# EAGLE design iBolit_main (EAGLE 7.5.0)
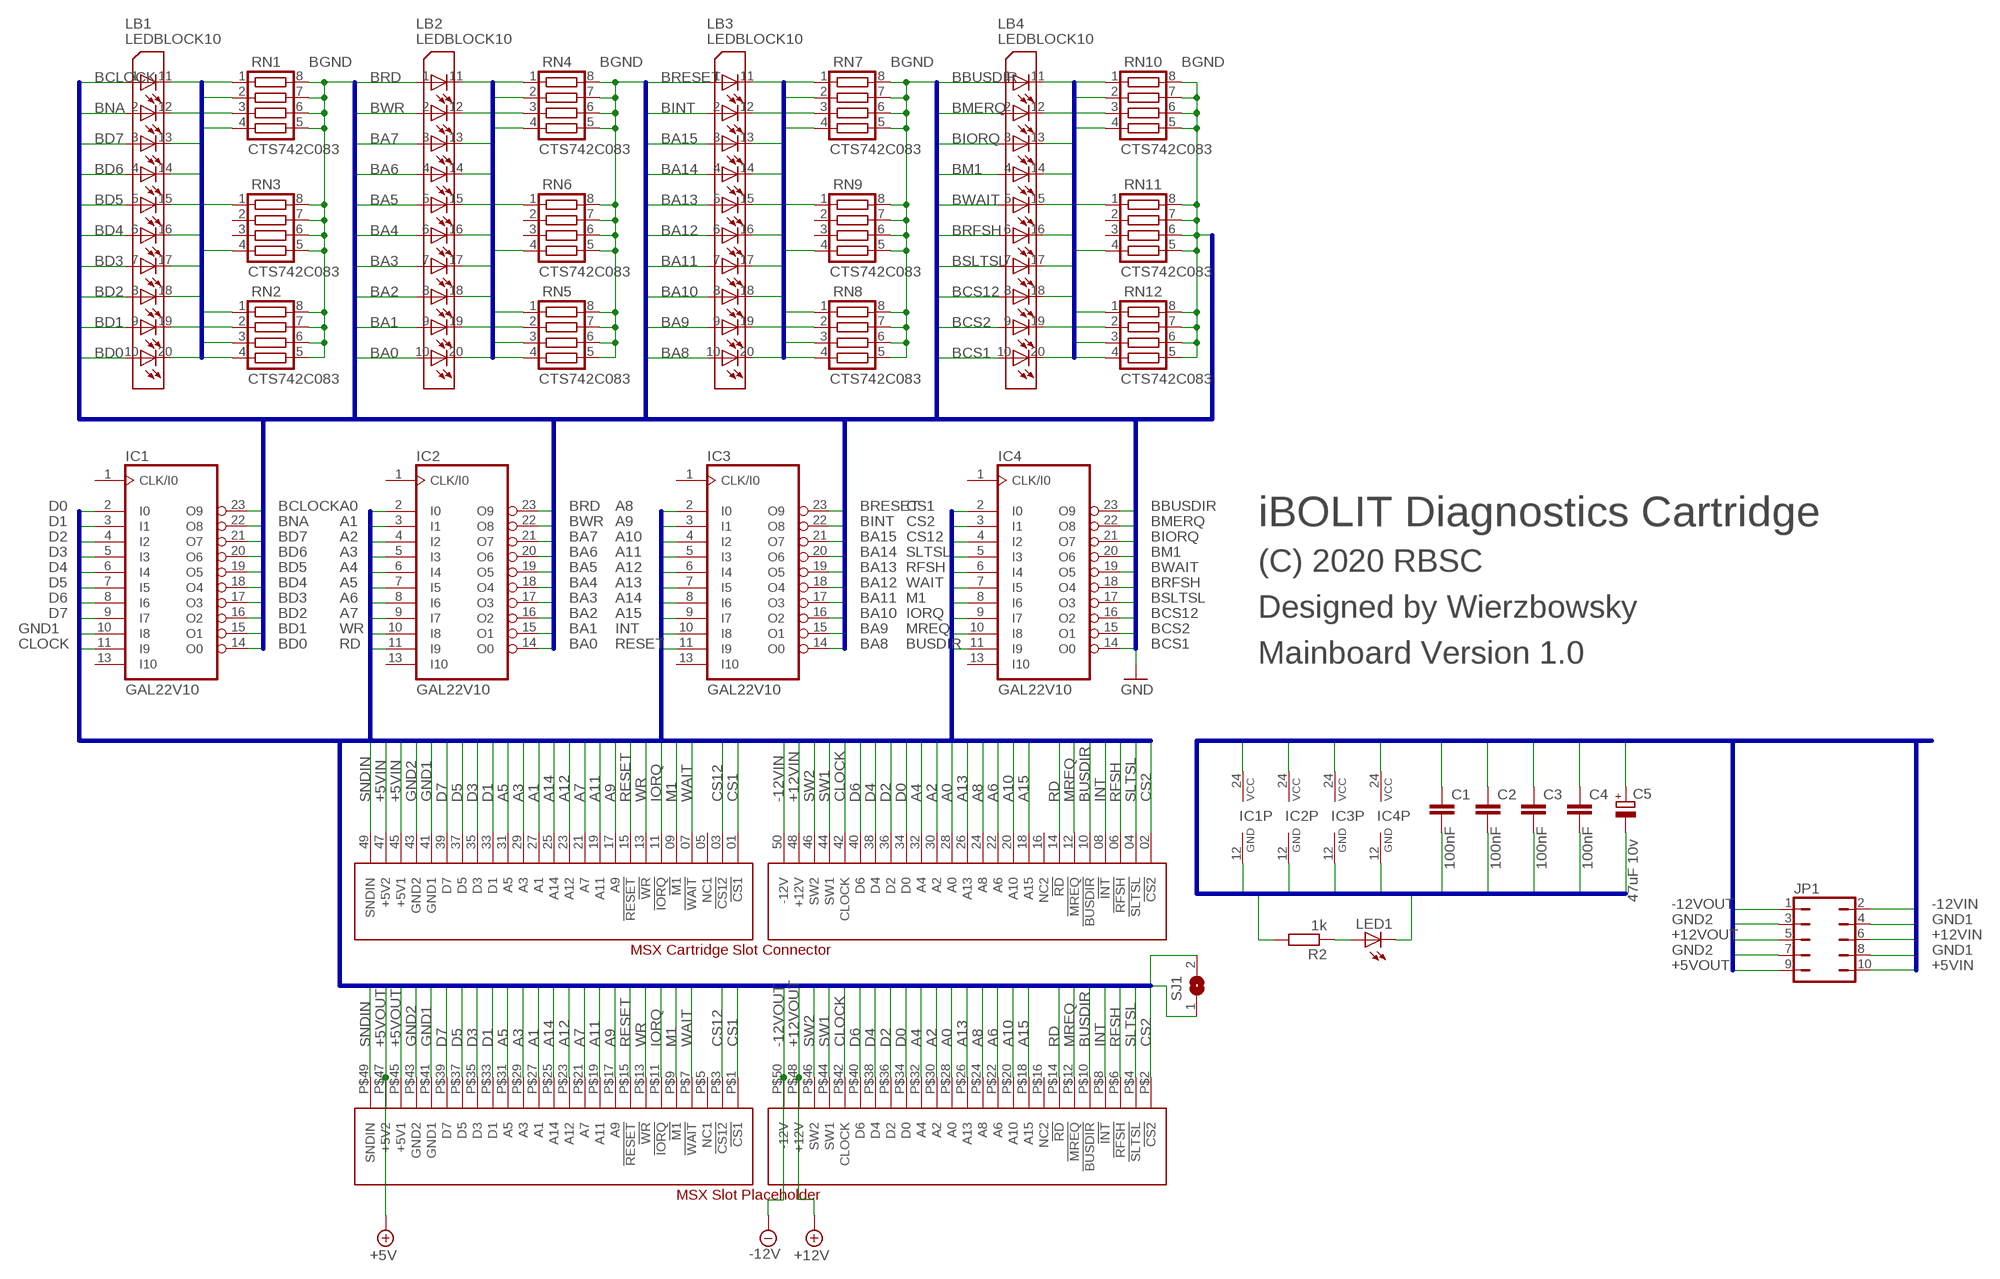
[diagram p0: schematic, sheet 1]

## Parts
C1  100nF  C-EUC0805  [C0805]
C2  100nF  C-EUC0805  [C0805]
C3  100nF  C-EUC0805  [C0805]
C4  100nF  C-EUC0805  [C0805]
C5  47uF 10v  CPOL-EUSMCB  [SMC_B]
CN1  SLOTCONN  MSX_SLOT_CON  [MSX_SLOT_CON]
CN2  SLOTPLACEHOLDER  MSX_SLOT_PLACEHOLDER  [MSX_SLOT_PLP]
IC1  GAL22V10  22V10  [DIL24-3]
IC2  GAL22V10  22V10  [DIL24-3]
IC3  GAL22V10  22V10  [DIL24-3]
IC4  GAL22V10  22V10  [DIL24-3]
JP1  JP5Q_CUSTOM  [JP5Q_CUSTOM]
LB1  LEDBLOCK10  [LB10]
LB2  LEDBLOCK10  [LB10]
LB3  LEDBLOCK10  [LB10]
LB4  LEDBLOCK10  [LB10]
LED1  LED5MM  [LED5MM]
R2  1k  R-EU_R0805  [R0805]
RN1  CTS742C083  [CTS742C083]
RN2  CTS742C083  [CTS742C083]
RN3  CTS742C083  [CTS742C083]
RN4  CTS742C083  [CTS742C083]
RN5  CTS742C083  [CTS742C083]
RN6  CTS742C083  [CTS742C083]
RN7  CTS742C083  [CTS742C083]
RN8  CTS742C083  [CTS742C083]
RN9  CTS742C083  [CTS742C083]
RN10  CTS742C083  [CTS742C083]
RN11  CTS742C083  [CTS742C083]
RN12  CTS742C083  [CTS742C083]
SJ1  SJ  [SJ]

## Nets
1: LB1.11(L1O) RN1.4
1A: LB2.11(L1O) RN4.4
1B: LB3.11(L1O) RN7.4
1C: LB4.11(L1O) RN10.4
2: LB1.12(L1O1) RN1.3
2A: LB2.12(L1O1) RN4.3
2B: LB3.12(L1O1) RN7.3
2C: LB4.12(L1O1) RN10.3
3: LB1.13(L1O2) RN1.2
3A: LB2.13(L1O2) RN4.2
3B: LB3.13(L1O2) RN7.2
3C: LB4.13(L1O2) RN10.2
4: LB1.14(L1O3) RN1.1
4A: LB2.14(L1O3) RN4.1
4B: LB3.14(L1O3) RN7.1
4C: LB4.14(L1O3) RN10.1
5: LB1.15(L1O4) RN3.4
5A: LB2.15(L1O4) RN6.4
5B: LB3.15(L1O4) RN9.4
5C: LB4.15(L1O4) RN11.4
6: LB1.16(L1O5) RN3.1
6A: LB2.16(L1O5) RN6.1
6B: LB3.16(L1O5) RN9.1
6C: LB4.16(L1O5) RN11.1
7: LB1.17(L1O6) RN2.4
7A: LB2.17(L1O6) RN5.4
7B: LB3.17(L1O6) RN8.4
7C: LB4.17(L1O6) RN12.4
8: LB1.18(L1O7) RN2.3
8A: LB2.18(L1O7) RN5.3
8B: LB3.18(L1O7) RN8.3
8C: LB4.18(L1O7) RN12.3
9: LB1.19(L1O8) RN2.2
9A: LB2.19(L1O8) RN5.2
9B: LB3.19(L1O8) RN8.2
9C: LB4.19(L1O8) RN12.2
10: LB1.20(L1O9) RN2.1
10A: LB2.20(L1O9) RN5.1
10B: LB3.20(L1O9) RN8.1
10C: LB4.20(L1O9) RN12.1
+5VIN: C1.1 C2.1 C3.1 C4.1 C5.+ CN1.45(+5V1) CN1.47(+5V2) IC1.24(VCC) IC2.24(VCC) IC3.24(VCC) IC4.24(VCC) JP1.10 R2.2
+5VOUT: CN2.P$45(+5V1) CN2.P$47(+5V2) JP1.9 ; supply symbol labelled +5V
+12VIN: CN1.48(+12V) JP1.6
+12VOUT: CN2.P$48(+12V) JP1.5 ; supply symbol labelled +12V
-12VIN: CN1.50(-12V) JP1.2
-12VOUT: CN2.P$50(-12V) JP1.1 ; supply symbol labelled -12V
A0: CN1.28(A0) CN2.P$28(A0) IC2.2(I0)
A1: CN1.27(A1) CN2.P$27(A1) IC2.3(I1)
A2: CN1.30(A2) CN2.P$30(A2) IC2.4(I2)
A3: CN1.29(A3) CN2.P$29(A3) IC2.5(I3)
A4: CN1.32(A4) CN2.P$32(A4) IC2.6(I4)
A5: CN1.31(A5) CN2.P$31(A5) IC2.7(I5)
A6: CN1.22(A6) CN2.P$22(A6) IC2.8(I6)
A7: CN1.21(A7) CN2.P$21(A7) IC2.9(I7)
A8: CN1.24(A8) CN2.P$24(A8) IC3.2(I0)
A9: CN1.17(A9) CN2.P$17(A9) IC3.3(I1)
A10: CN1.20(A10) CN2.P$20(A10) IC3.4(I2)
A11: CN1.19(A11) CN2.P$19(A11) IC3.5(I3)
A12: CN1.23(A12) CN2.P$23(A12) IC3.6(I4)
A13: CN1.26(A13) CN2.P$26(A13) IC3.7(I5)
A14: CN1.25(A14) CN2.P$25(A14) IC3.8(I6)
A15: CN1.18(A15) CN2.P$18(A15) IC3.9(I7)
BA0: IC2.14(O0) LB2.10(L1I9)
BA1: IC2.15(O1) LB2.9(L1I8)
BA2: IC2.16(O2) LB2.8(L1I7)
BA3: IC2.17(O3) LB2.7(L1I6)
BA4: IC2.18(O4) LB2.6(L1I5)
BA5: IC2.19(O5) LB2.5(L1I4)
BA6: IC2.20(O6) LB2.4(L1I3)
BA7: IC2.21(O7) LB2.3(L1I2)
BA8: IC3.14(O0) LB3.10(L1I9)
BA9: IC3.15(O1) LB3.9(L1I8)
BA10: IC3.16(O2) LB3.8(L1I7)
BA11: IC3.17(O3) LB3.7(L1I6)
BA12: IC3.18(O4) LB3.6(L1I5)
BA13: IC3.19(O5) LB3.5(L1I4)
BA14: IC3.20(O6) LB3.4(L1I3)
BA15: IC3.21(O7) LB3.3(L1I2)
BBUSDIR: IC4.23(O9) LB4.1(L1I)
BCLOCK: IC1.23(O9) LB1.1(L1I)
BCS1: IC4.14(O0) LB4.10(L1I9)
BCS2: IC4.15(O1) LB4.9(L1I8)
BCS12: IC4.16(O2) LB4.8(L1I7)
BD0: IC1.14(O0) LB1.10(L1I9)
BD1: IC1.15(O1) LB1.9(L1I8)
BD2: IC1.16(O2) LB1.8(L1I7)
BD3: IC1.17(O3) LB1.7(L1I6)
BD4: IC1.18(O4) LB1.6(L1I5)
BD5: IC1.19(O5) LB1.5(L1I4)
BD6: IC1.20(O6) LB1.4(L1I3)
BD7: IC1.21(O7) LB1.3(L1I2)
BGND: RN1.5 RN1.6 RN1.7 RN1.8 RN2.5 RN2.6 RN2.7 RN2.8 RN3.5 RN3.6 RN3.7 RN3.8 RN4.5 RN4.6 RN4.7 RN4.8 RN5.5 RN5.6 RN5.7 RN5.8 RN6.5 RN6.6 RN6.7 RN6.8 RN7.5 RN7.6 RN7.7 RN7.8 RN8.5 RN8.6 RN8.7 RN8.8 RN9.5 RN9.6 RN9.7 RN9.8 RN10.5 RN10.6 RN10.7 RN10.8 RN11.5 RN11.6 RN11.7 RN11.8 RN12.5 RN12.6 RN12.7 RN12.8 ; supply symbol labelled GND
BINT: IC3.22(O8) LB3.2(L1I1)
BIORQ: IC4.21(O7) LB4.3(L1I2)
BM1: IC4.20(O6) LB4.4(L1I3)
BMERQ: IC4.22(O8) LB4.2(L1I1)
BNA: IC1.22(O8) LB1.2(L1I1)
BRD: IC2.23(O9) LB2.1(L1I)
BRESET: IC3.23(O9) LB3.1(L1I)
BRFSH: IC4.18(O4) LB4.6(L1I5)
BSLTSL: IC4.17(O3) LB4.7(L1I6)
BUSDIR: CN1.10(!BUSDIR) CN2.P$10(!BUSDIR) IC4.11(I9)
BWAIT: IC4.19(O5) LB4.5(L1I4)
BWR: IC2.22(O8) LB2.2(L1I1)
CLOCK: CN1.42(CLOCK) CN2.P$42(CLOCK) IC1.11(I9)
CS1: CN1.01(!CS1) CN2.P$1(!CS1) IC4.2(I0)
CS2: CN1.02(!CS2) CN2.P$2(!CS2) IC4.3(I1)
CS12: CN1.03(!CS12) CN2.P$3(!CS12) IC4.4(I2)
D0: CN1.34(D0) CN2.P$34(D0) IC1.2(I0)
D1: CN1.33(D1) CN2.P$33(D1) IC1.3(I1)
D2: CN1.36(D2) CN2.P$36(D2) IC1.4(I2)
D3: CN1.35(D3) CN2.P$35(D3) IC1.5(I3)
D4: CN1.38(D4) CN2.P$38(D4) IC1.6(I4)
D5: CN1.37(D5) CN2.P$37(D5) IC1.7(I5)
D6: CN1.40(D6) CN2.P$40(D6) IC1.8(I6)
D7: CN1.39(D7) CN2.P$39(D7) IC1.9(I7)
GND1: C1.2 C2.2 C3.2 C4.2 C5.- CN1.41(GND1) CN2.P$41(GND1) IC1.10(I8) IC1.12(GND) IC2.12(GND) IC3.12(GND) IC4.12(GND) JP1.4 JP1.8 LED1.K(C)
GND2: CN1.43(GND2) CN2.P$43(GND2) JP1.3 JP1.7
INT: CN1.08(!INT) CN2.P$8(!INT) IC3.10(I8)
IORQ: CN1.11(!IORQ) CN2.P$11(!IORQ) IC4.9(I7)
M1: CN1.09(!M1) CN2.P$9(!M1) IC4.8(I6)
MREQ: CN1.12(!MREQ) CN2.P$12(!MREQ) IC4.10(I8)
N$1: LED1.A R2.1
RD: CN1.14(!RD) CN2.P$14(!RD) IC2.11(I9)
RESET: CN1.15(!RESET) CN2.P$15(!RESET) IC3.11(I9)
RFSH: CN1.06(!RFSH) CN2.P$6(!RFSH) IC4.6(I4)
SLTSL: CN1.04(!SLTSL) CN2.P$4(!SLTSL) IC4.5(I3)
SNDIN: CN1.49(SNDIN) CN2.P$49(SNDIN)
SW1: CN1.44(SW1) CN2.P$44(SW1) SJ1.2
SW2: CN1.46(SW2) CN2.P$46(SW2) SJ1.1
WAIT: CN1.07(!WAIT) CN2.P$7(!WAIT) IC4.7(I5)
WR: CN1.13(!WR) CN2.P$13(!WR) IC2.10(I8)
Unconnected: CN1.05(NC1) CN1.16(NC2) CN2.P$5(NC1) CN2.P$16(NC2) IC1.1(CLK/I0) IC1.13(I10) IC2.1(CLK/I0) IC2.13(I10) IC3.1(CLK/I0) IC3.13(I10) IC4.1(CLK/I0) IC4.13(I10) RN3.2 RN3.3 RN6.2 RN6.3 RN9.2 RN9.3 RN11.2 RN11.3

## Buses
D0,D1,D2,D3,D4,D5,D6,D7,A0,A1,A2,A3,A4,A5,A6,A7,A8,A9,A10,A11,A12,A13,A14,A15,SLTSL,RFSH,WAIT,INT,M1,BUSDIR,IORQ,MERQ,WR,RD,RESET,GND,CLOCK,SW1,SW2,CS1,CS2,CS12,SNDIN,GND1,GND2,+5V1,+5V2,+12V,-12V,+5VIN,+5VOUT,+12VIN,+12VOUT,-12VIN,-12VOUT,MREQ
BD0,BD1,BD2,BD3,BD4,BD5,BD6,BD7,BA0,BA1,BA2,BA3,BA4,BA5,BA6,BA7,BA8,BA9,BA10,BA11,BA12,BA13,BA14,BA15,BSLTSL,BRFSH,BWAIT,BINT,BM1,BBUSDIR,BIORQ,BMERQ,BWR,BRD,BRESET,BGND,BCLOCK,BCS1,BCS2,BCS12,BNA
1,2,3,4,5,6,7,8,9,10
1A,2A,3A,4A,5A,6A,7A,8A,9A,10A
1B,2B,3B,4B,5B,6B,7B,8B,9B,10B
1C,2C,3C,4C,5C,6C,7C,8C,9C,10C

## Notes on the sheet
- iBOLIT Diagnostics Cartridge
- (C) 2020 RBSC
- Designed by Wierzbowsky
- Mainboard Version 1.0

## Library data of the parts
C1-C4 = rcl:C-EU: CAPACITOR, European symbol
C5 = rcl:CPOL-EU: POLARIZED CAPACITOR, European symbol
CN1 = msx_edge_conn:MSX_SLOT_CON
CN2 = msx_slot_pl:MSX_SLOT_PLACEHOLDER
IC1-IC4 = pal:22V10: PAL; MPN: GAL22V10D-7LPN; OC_FARNELL: 1571925; OC_NEWARK: 97M0480
JP1 = jumper_custom:JP5Q_CUSTOM: JUMPER
LB1-LB4 = ledblock:LEDBLOCK10: LED BLOCK 10-LED bar graph, DIL, Siemens
LED1 = led:LED: LED OSRAM: - CHIPLED LG R971, LG N971, LY N971, LG Q971, LY Q971, LO R971, LY R971 LH N974, LH R974 LS Q976, LO Q976, LY Q976 LO Q996 - Hyper CHIPLED LW Q18S LB Q993, LB Q99A, LB R99A - SideLED LS A670, LO A670, LY A670, LG A670, LP A670 LB A673, LV A673, LT A673, LW A673 LH A674 LY A675 LS A676, LA A676, LO A676, LY A676, LW A676 LS A679, LY A679, LG A679 - Hyper Micro SIDELED® LS Y876, LA Y876, LO Y876, LY Y876 LT Y87S - SmartLED LW L88C, LW L88S LB L89C, LB L89S, LG L890 LS L89K, LO L89K, LY L89K LS L896, LA L896, LO L896, LY L896 - TOPLED LS T670, LO T670, LY T670, LG T670, LP T670 LSG T670, LSP T670, LSY T670, LOP T670, LYG T670 LG T671, LOG T671, LSG T671 LB T673, LV T673, LT T673, LW T673 LH T674 LS T676, LA T676, LO T676, LY T676, LB T676, LH T676, LSB T676, LW T676 LB T67C, LV T67C, LT T67C, LS T67K, LO T67K, LY T67K, LW E67C LS E67B, LA E67B, LO E67B, LY E67B, LB E67C, LV E67C, LT E67C LW T67C LS T679, LY T679, LG T679 LS T770, LO T770, LY T770, LG T770, LP T770 LB T773, LV T773, LT T773, LW T773 LH T774 LS E675, LA E675, LY E675, LS T675 LS T776, LA T776, LO T776, LY T776, LB T776 LHGB T686 LT T68C, LB T68C - Hyper Mini TOPLED® LB M676 - Mini TOPLED Santana® LG M470 LS M47K, LO M47K, LY M47K Source: http://www.osram.convergy.de LUXEON: - LUMILED® LXK2-PW12-R00, LXK2-PW12-S00, LXK2-PW14-U00, LXK2-PW14-V00 LXK2-PM12-R00, LXK2-PM12-S00, LXK2-PM14-U00 LXK2-PE12-Q00, LXK2-PE12-R00, LXK2-PE12-S00, LXK2-PE14-T00, LXK2-PE14-U00 LXK2-PB12-K00, LXK2-PB12-L00, LXK2-PB12-M00, LXK2-PB14-N00, LXK2-PB14-P00, LXK2-PB14-Q00 LXK2-PR12-L00, LXK2-PR12-M00, LXK2-PR14-Q00, LXK2-PR14-R00 LXK2-PD12-Q00, LXK2-PD12-R00, LXK2-PD12-S00 LXK2-PH12-R00, LXK2-PH12-S00 LXK2-PL12-P00, LXK2-PL12-Q00, LXK2-PL12-R00 Source: www.luxeon.com KINGBRIGHT: KA-3528ASYC Source: www.kingbright.com
R2 = resistor:R-EU_: RESISTOR, European symbol
RN1-RN12 = resistor-net:CTS742C083: Chip Resistor Array 4 Single Resistor Source: http://www.ctscorp.com/components/Datasheets/CTSChipArrayDs.pdf; OC_FARNELL: unknown; OC_NEWARK: unknown
SJ1 = jumper:SJ: SMD solder JUMPER

## Board
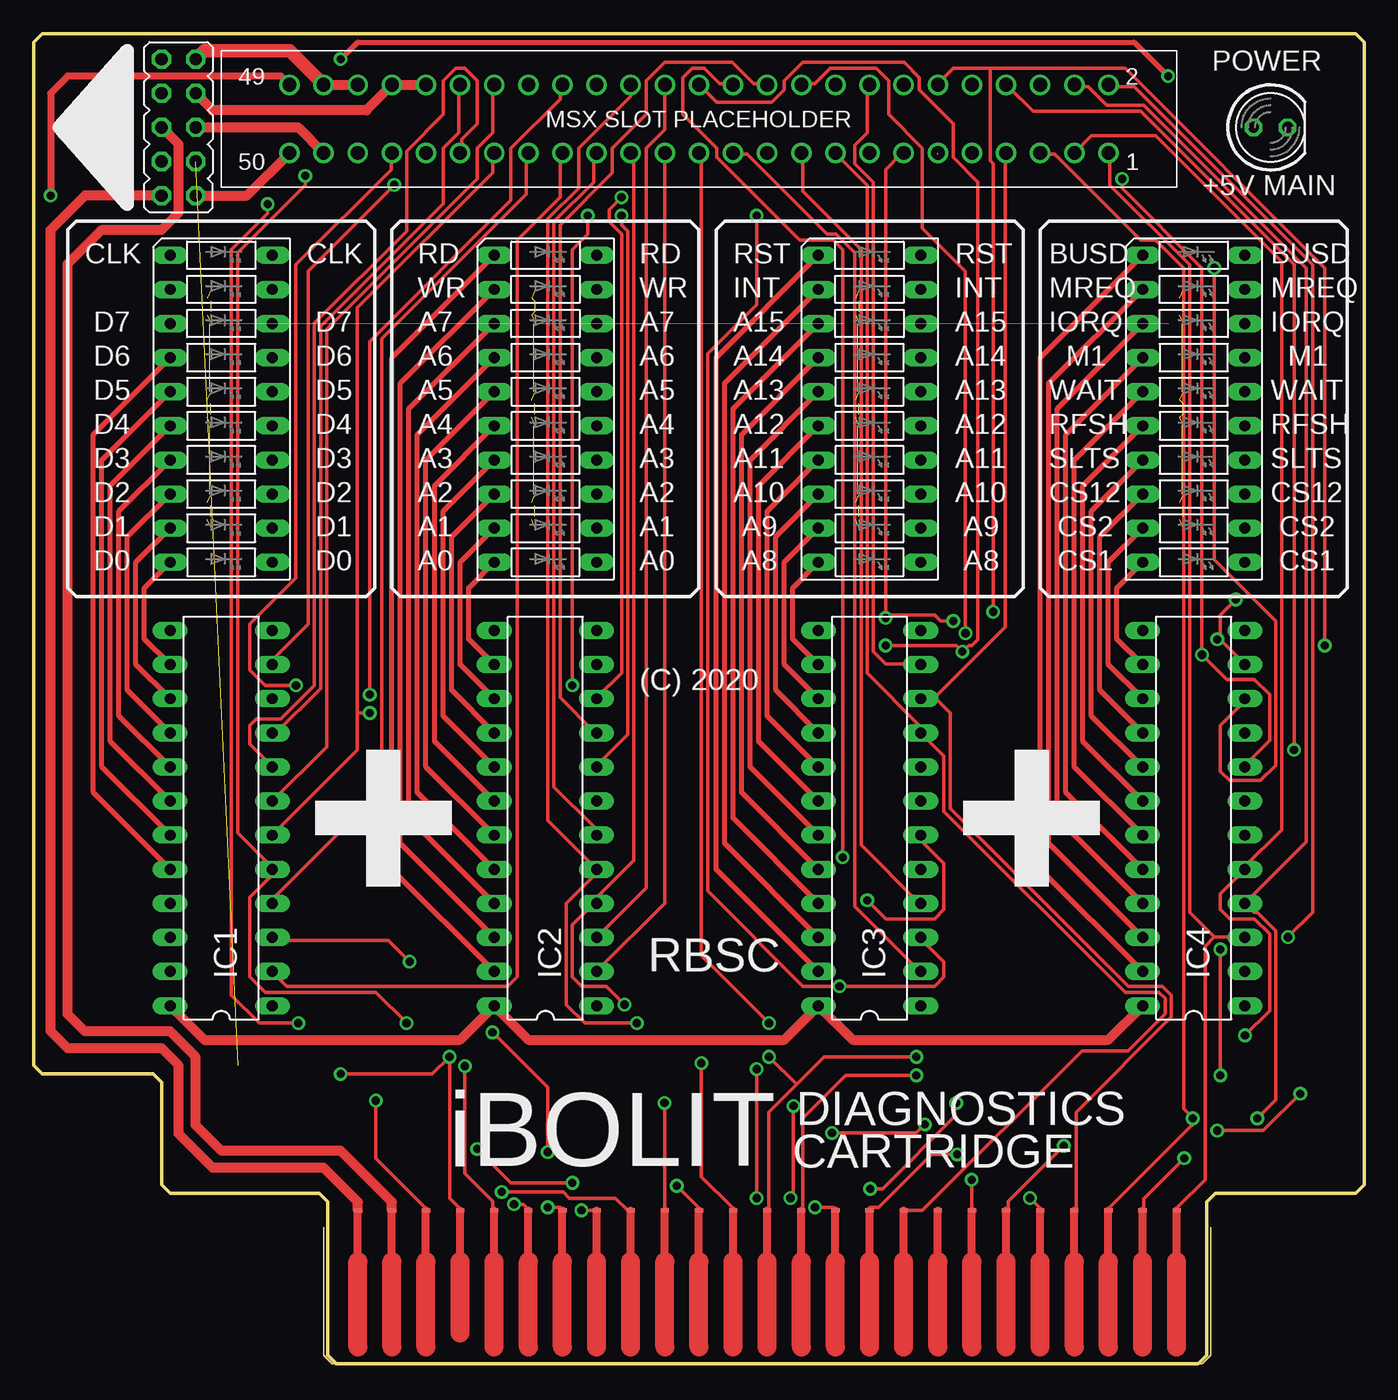
[diagram p1: board, top side]
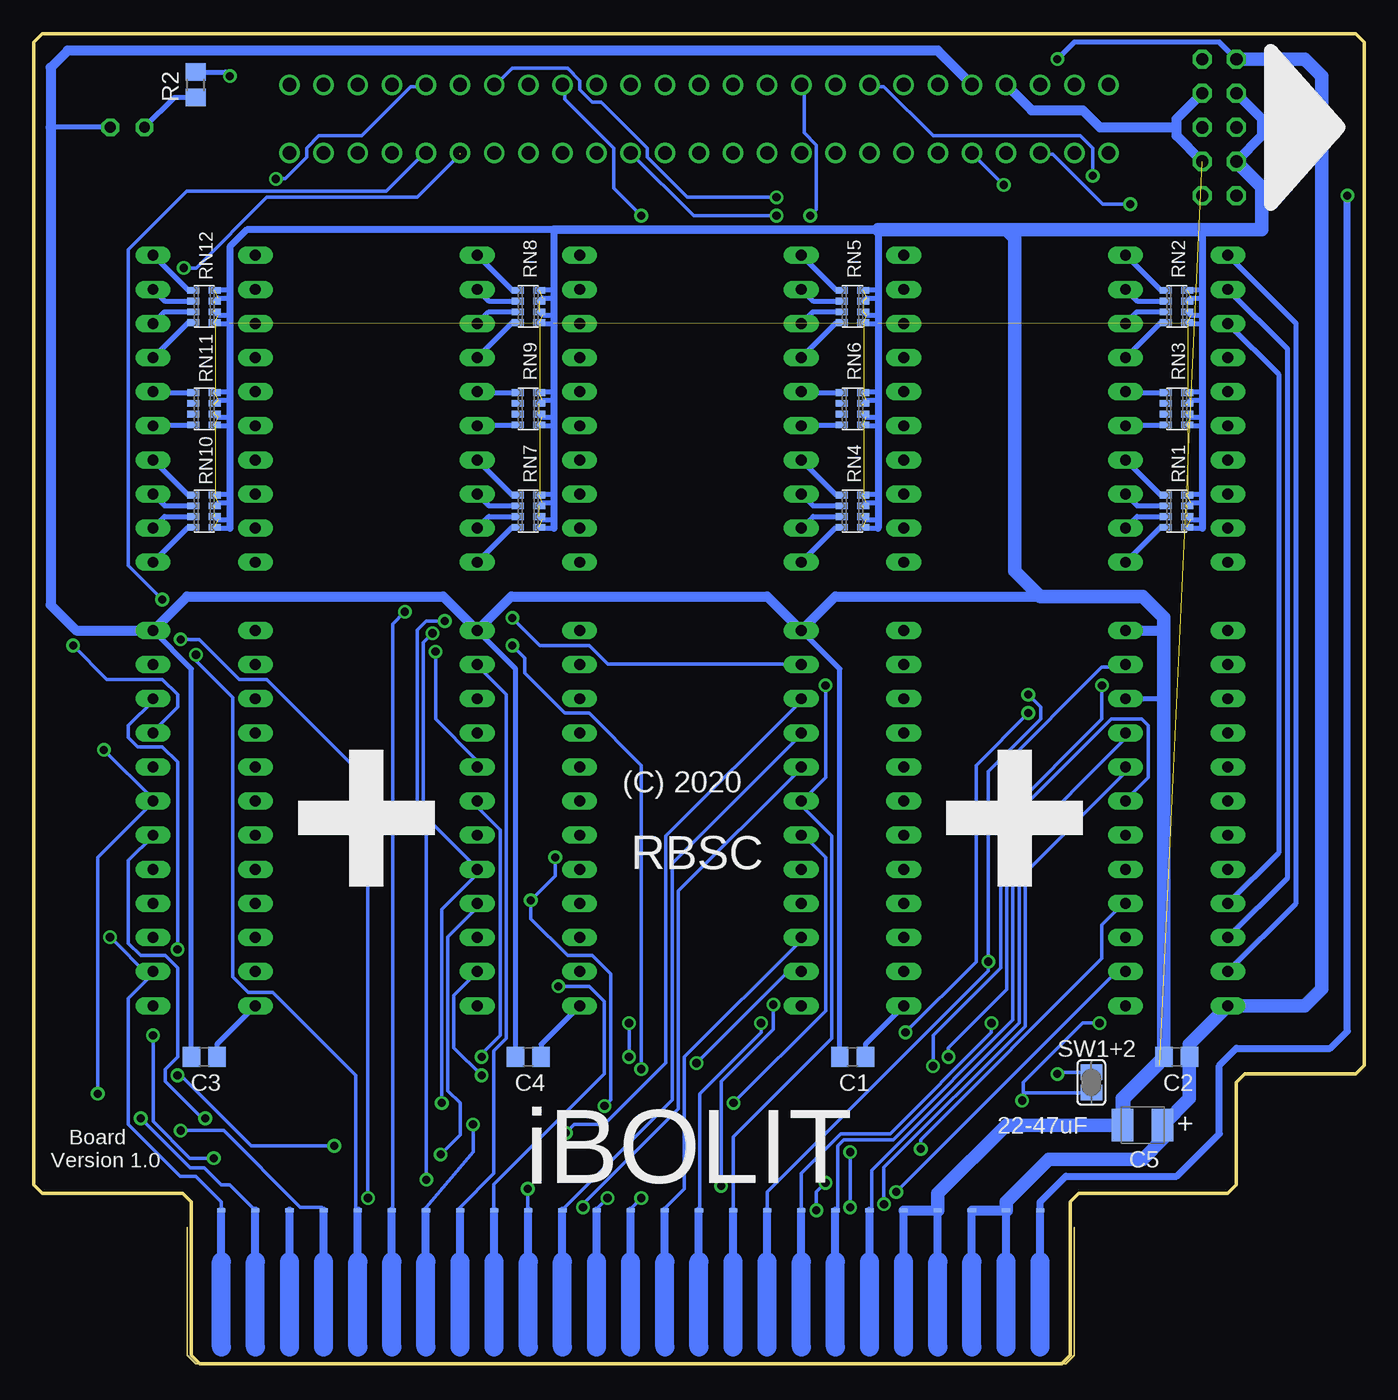
[diagram p2: board, bottom side, seen from below]

Size 99.06 x 99.06 mm. Coordinates in mm from the lower left corner, seen from the top.
Outline: 87.95,12.7 98.42,12.7 99.06,13.34 99.06,98.42 98.42,99.06 0.64,99.06 0,98.42 0,22.23 0.64,21.59 8.89,21.59 9.53,20.95 9.53,13.34 10.16,12.7 21.27,12.7 21.91,12.06 21.91,0.64 22.54,0 86.68,0 87.31,0.64 87.31,12.06 87.95,12.7
Copper layers (1*16): Top 0.035mm / dielectric 1.5mm / Bottom 0.035mm
Design rules "default *": minimum track width 10mil, minimum drill 24mil, track to track 8mil, track to pad 8mil, pad to pad 8mil, via to via 8mil, smd to smd 8mil, copper to edge 10mil, drill to drill 8mil, minimum pad ring 10mil, minimum via ring 8mil, stop-mask expansion 4mil, vias tented up to drill 25mil, thermal gap 20mil

### Footprints (pad centres in the part's own frame; a part is rotated, then mirrored left to right if it is on the bottom)
C0805 = smd 1.3 x 1.5: 1 -0.95,0; 2 0.95,0
SMC_B = smd 1.6 x 2.4: + -1.5,0; - 1.5,0
MSX_SLOT_CON = smd 0.61 x 0.305 bottom: 01 30.48,11.43; 03 27.94,11.43; 05 25.4,11.43; 07 22.86,11.43; 09 20.32,11.43; 11 17.78,11.43; 13 15.24,11.43; 15 12.7,11.43; 17 10.16,11.43; 19 7.62,11.43; 21 5.08,11.43; 23 2.54,11.43; 25 0,11.43; 27 -2.54,11.43; 29 -5.08,11.43; 31 -7.62,11.43; 33 -10.16,11.43; 35 -12.7,11.43; 37 -15.24,11.43; 39 -17.78,11.43; 41 -20.32,11.43; 43 -22.86,11.43; 45 -25.4,11.43; 47 -27.94,11.43; 49 -30.48,11.43 | smd 0.61 x 0.305: 02 30.48,11.43; 04 27.94,11.43; 06 25.4,11.43; 08 22.86,11.43; 10 20.32,11.43; 12 17.78,11.43; 14 15.24,11.43; 16 12.7,11.43; 18 10.16,11.43; 20 7.62,11.43; 22 5.08,11.43; 24 2.54,11.43; 26 0,11.43; 28 -2.54,11.43; 30 -5.08,11.43; 32 -7.62,11.43; 34 -10.16,11.43; 36 -12.7,11.43; 38 -15.24,11.43; 40 -17.78,11.43; 42 -20.32,11.43; 44 -22.86,11.43; 46 -25.4,11.43; 48 -27.94,11.43; 50 -30.48,11.43
MSX_SLOT_PLP = drill 1.016: P$1 63.5,7.62; P$2 63.5,2.54; P$3 60.96,7.62; P$4 60.96,2.54; P$5 58.42,7.62; P$6 58.42,2.54; P$7 55.88,7.62; P$8 55.88,2.54; P$9 53.34,7.62; P$10 53.34,2.54; P$11 50.8,7.62; P$12 50.8,2.54; P$13 48.26,7.62; P$14 48.26,2.54; P$15 45.72,7.62; P$16 45.72,2.54; P$17 43.18,7.62; P$18 43.18,2.54; P$19 40.64,7.62; P$20 40.64,2.54; P$21 38.1,7.62; P$22 38.1,2.54; P$23 35.56,7.62; P$24 35.56,2.54; P$25 33.02,7.62; P$26 33.02,2.54; P$27 30.48,7.62; P$28 30.48,2.54; P$29 27.94,7.62; P$30 27.94,2.54; P$31 25.4,7.62; P$32 25.4,2.54; P$33 22.86,7.62; P$34 22.86,2.54; P$35 20.32,7.62; P$36 20.32,2.54; P$37 17.78,7.62; P$38 17.78,2.54; P$39 15.24,7.62; P$40 15.24,2.54; P$41 12.7,7.62; P$42 12.7,2.54; P$43 10.16,7.62; P$44 10.16,2.54; P$45 7.62,7.62; P$46 7.62,2.54; P$47 5.08,7.62; P$48 5.08,2.54; P$49 2.54,7.62; P$50 2.54,2.54
DIL24-3 = drill 0.813 long: 1 -13.97,-3.81; 2 -11.43,-3.81; 3 -8.89,-3.81; 4 -6.35,-3.81; 5 -3.81,-3.81; 6 -1.27,-3.81; 7 1.27,-3.81; 8 3.81,-3.81; 9 6.35,-3.81; 10 8.89,-3.81; 11 11.43,-3.81; 12 13.97,-3.81; 13 13.97,3.81; 14 11.43,3.81; 15 8.89,3.81; 16 6.35,3.81; 17 3.81,3.81; 18 1.27,3.81; 19 -1.27,3.81; 20 -3.81,3.81; 21 -6.35,3.81; 22 -8.89,3.81; 23 -11.43,3.81; 24 -13.97,3.81
JP5Q_CUSTOM = drill 0.914 octagon: 1 -5.08,-1.27; 2 -5.08,1.27; 3 -2.54,-1.27; 4 -2.54,1.27; 5 0,-1.27; 6 0,1.27; 7 2.54,-1.27; 8 2.54,1.27; 9 5.08,-1.27; 10 5.08,1.27
LB10 = drill 0.813 long: 1 -11.43,-3.81; 2 -8.89,-3.81; 3 -6.35,-3.81; 4 -3.81,-3.81; 5 -1.27,-3.81; 6 1.27,-3.81; 7 3.81,-3.81; 8 6.35,-3.81; 9 8.89,-3.81; 10 11.43,-3.81; 11 11.43,3.81; 12 8.89,3.81; 13 6.35,3.81; 14 3.81,3.81; 15 1.27,3.81; 16 -1.27,3.81; 17 -3.81,3.81; 18 -6.35,3.81; 19 -8.89,3.81; 20 -11.43,3.81
LED5MM = drill 0.813 octagon: A -1.27,0; K 1.27,0
R0805 = smd 1.3 x 1.5: 1 -0.95,0; 2 0.95,0
CTS742C083 = smd 0.5 x 0.9: 1 -1.2,-0.8; 2 -0.4,-0.8; 3 0.4,-0.8; 4 1.2,-0.8; 5 1.2,0.8; 6 0.4,0.8; 7 -0.4,0.8; 8 -1.2,0.8
SJ = smd 1.168 x 1.6: 1 -0.762,0; 2 0.762,0

### Placement (x,y rotation side)
C1  38.1,22.86 180 bottom
C2  13.97,22.86 180 bottom
C3  86.36,22.86 180 bottom
C4  62.23,22.86 180 bottom
C5  16.51,17.78 180 bottom
CN1  54.61,0 0 top
CN2  16.51,87.63 0 top
IC1  13.97,40.64 90 top
IC2  38.1,40.64 90 top
IC3  62.23,40.64 90 top
IC4  86.36,40.64 90 top
JP1  10.79,92.08 90 top
LB1  13.97,71.12 270 top
LB2  38.1,71.12 270 top
LB3  62.23,71.12 270 top
LB4  86.36,71.12 270 top
LED1  92.08,92.08 0 top
R2  87,95.25 90 bottom
RN1  13.97,63.5 270 bottom
RN2  13.97,78.74 270 bottom
RN3  13.97,71.12 270 bottom
RN4  38.1,63.5 270 bottom
RN5  38.1,78.74 270 bottom
RN6  38.1,71.12 270 bottom
RN7  62.23,63.5 270 bottom
RN8  62.23,78.74 270 bottom
RN9  62.23,71.12 270 bottom
RN10  86.36,63.5 270 bottom
RN11  86.36,71.12 270 bottom
RN12  86.36,78.74 270 bottom
SJ1  20.32,20.95 90 bottom

### Tracks (layer width: path | path; a pad name or v marks a point on that pad's centre or on a via)
1
  Bottom 0.381: LB1.11 15.17,62.3 RN1.4
1A
  Bottom 0.381: LB2.11 39.3,62.3 RN4.4
1B
  Bottom 0.381: LB3.11 63.43,62.3 RN7.4
1C
  Bottom 0.381: LB4.11 87.56,62.3 RN10.4
2
  Bottom 0.381: LB1.12 16.91,63.1 RN1.3
2A
  Bottom 0.381: LB2.12 41.04,63.1 RN4.3
2B
  Bottom 0.381: LB3.12 65.17,63.1 RN7.3
2C
  Bottom 0.381: LB4.12 89.3,63.1 RN10.3
3
  Bottom 0.381: LB1.13 16.91,63.9 RN1.2
3A
  Bottom 0.381: LB2.13 41.04,63.9 RN4.2
3B
  Bottom 0.381: LB3.13 65.17,63.9 RN7.2
3C
  Bottom 0.381: LB4.13 89.3,63.9 RN10.2
4
  Bottom 0.381: LB1.14 15.17,64.7 RN1.1
4A
  Bottom 0.381: LB2.14 39.3,64.7 RN4.1
4B
  Bottom 0.381: LB3.14 63.43,64.7 RN7.1
4C
  Bottom 0.381: LB4.14 87.56,64.7 RN10.1
5
  Bottom 0.381: LB1.15 17.71,69.92 RN3.4
5A
  Bottom 0.381: LB2.15 41.84,69.92 RN6.4
5B
  Bottom 0.381: LB3.15 65.97,69.92 RN9.4
5C
  Bottom 0.381: LB4.15 90.1,69.92 RN11.4
6
  Bottom 0.381: LB1.16 17.71,72.32 RN3.1
6A
  Bottom 0.381: LB2.16 41.84,72.32 RN6.1
6B
  Bottom 0.381: LB3.16 65.97,72.32 RN9.1
6C
  Bottom 0.381: LB4.16 90.1,72.32 RN11.1
7
  Bottom 0.381: LB1.17 15.17,77.54 RN2.4
7A
  Bottom 0.381: LB2.17 39.3,77.54 RN5.4
7B
  Bottom 0.381: LB3.17 63.43,77.54 RN8.4
7C
  Bottom 0.381: LB4.17 87.56,77.54 RN12.4
8
  Bottom 0.381: LB1.18 16.91,78.34 RN2.3
8A
  Bottom 0.381: LB2.18 41.04,78.34 RN5.3
8B
  Bottom 0.381: LB3.18 65.17,78.34 RN8.3
8C
  Bottom 0.381: LB4.18 89.3,78.34 RN12.3
9
  Bottom 0.381: LB1.19 16.91,79.14 RN2.2
9A
  Bottom 0.381: LB2.19 41.04,79.14 RN5.2
9B
  Bottom 0.381: LB3.19 65.17,79.14 RN8.2
9C
  Bottom 0.381: LB4.19 89.3,79.14 RN12.2
10
  Bottom 0.381: LB1.20 15.17,79.94 RN2.1
10A
  Bottom 0.381: LB2.20 39.3,79.94 RN5.1
10B
  Bottom 0.381: LB3.20 63.43,79.94 RN8.1
10C
  Bottom 0.381: LB4.20 87.56,79.94 RN12.1
+5VIN  (via drill 0.6)
  Top 0.381: v22.86,97.16 24.13,98.42 81.92,98.42 v84.45,95.89
  Top 0.762: IC1.24 12.7,24.13 31.75,24.13 IC2.24 36.83,24.13 55.88,24.13 IC3.24 60.96,24.13 80.01,24.13 IC4.24
  Bottom 0.381: IC4.24 85.41,23.81 C3.1 | IC3.24 61.28,23.81 C4.1 | IC2.24 37.15,23.81 C1.1 | v22.86,97.16 21.59,98.42 10.79,98.42 JP1.10 | R2.2 84.77,96.2 v84.45,95.89
  Bottom 0.762: 15.01,16.74 C5.+ | CN1.45 CN1.47
  Bottom 1.016: CN1.47 26.67,12.06 23.5,15.24 16.51,15.24 15.01,16.74 | C5.+ 13.02,19.77 C2.1 13.02,23.81 IC1.24 4.45,26.67 3.18,27.94 3.18,95.89 4.45,97.16 JP1.10
+5VOUT
  Top 0.762: CN2.P$47 CN2.P$45
  Top 1.016: CN2.P$47 19.05,97.79 12.7,97.79 JP1.9
+12VIN
  Top 0.762: CN1.48 26.67,12.06 22.86,15.88 13.97,15.88 12.07,17.78 12.07,22.86 10.16,24.77 3.81,24.77 2.54,26.04 2.54,81.92 5.08,84.45 9.53,84.45 10.79,85.72 10.79,90.81 JP1.6
+12VOUT
  Top 0.762: JP1.5 19.68,92.08 CN2.P$48
-12VIN
  Top 0.762: CN1.50 24.13,12.06 21.59,14.61 13.34,14.61 10.79,17.14 10.79,22.23 9.53,23.5 2.54,23.5 1.27,24.77 1.27,84.45 3.81,87 JP1.2
-12VOUT
  Top 0.762: JP1.1 15.88,87 CN2.P$50
A0  (via drill 0.61)
  Top 0.254: v49.71,22.4 49.71,13.95 51.99,11.66 52.07,7.62 | CN2.P$28 46.96,90.07 46.96,34.29 41.93,29.26 IC2.2
  Bottom 0.254: v49.71,22.4 43.08,29.03 41.93,29.03 IC2.2
A1
  Top 0.254: IC2.3 45.59,35.43 45.59,90.53 46.96,91.9 46.96,95.1 CN2.P$27
  Bottom 0.254: IC2.3 41.93,31.55 50.62,22.86 50.62,13.03 51.99,11.66 52.07,7.62
A2  (via drill 0.61)
  Top 0.254: CN2.P$30 44.45,90.07 44.68,89.84 44.68,37.49 41.93,34.75 41.93,34.29 IC2.4 41.71,34.29 40.11,32.69 40.11,28.8 40.79,28.12 42.62,28.12 v43.99,26.75 | v47.88,13.26 49.48,11.66 49.53,7.62
  Bottom 0.254: v47.88,13.26 47.88,21.03 43.99,24.92 v43.99,26.75
A3  (via drill 0.61)
  Top 0.254: v44.91,25.38 41.02,25.38 39.65,26.75 39.65,34.29 41.71,36.35 41.71,36.8 IC2.5 38.28,40.46 38.28,85.27 40.56,87.55 40.56,90.53 44.45,94.41 CN2.P$29
  Bottom 0.254: v44.91,25.38 44.91,24.69 49.48,20.12 49.48,11.66 49.53,7.62
A4  (via drill 0.61)
  Top 0.254: IC2.6 41.71,39.55 41.71,40.01 38.73,42.98 38.73,85.04 41.71,88.01 41.71,90.07 CN2.P$32 | v46.96,19.43 46.96,11.66 46.99,7.62
  Bottom 0.254: v46.96,19.43 40.11,26.29 40.11,37.72 41.71,39.32 IC2.6
A5  (via drill 0.61)
  Top 0.254: v41.25,85.5 41.25,84.12 40.11,82.98 v40.11,50.52
  Bottom 0.254: 46.99,7.62 46.96,11.66 46.96,16.92 39.65,24.23 39.65,39.32 41.71,41.38 41.71,41.83 IC2.7 41.71,42.06 40.11,43.66 v40.11,50.52 | v41.25,85.5 40.79,85.95 40.79,90.75 41.71,91.67 41.71,95.1 CN2.P$31
A6  (via drill 0.61)
  Top 0.254: v58.17,11.66 59.54,11.66 59.69,7.62 | v43.76,85.5 43.76,84.81 44.22,84.35 44.22,46.86 41.93,44.58 IC2.8
  Bottom 0.254: v58.17,11.66 58.17,11.89 51.08,18.97 51.08,35.2 41.93,44.35 IC2.8 | CN2.P$22 49.94,85.5 v43.76,85.5
A7
  Top 0.254: CN2.P$21 54.51,95.33 53.59,95.33 51.99,96.93 46.96,96.93 45.59,95.56 45.59,93.04 43.08,90.53 43.08,88.7 39.19,84.81 39.19,49.61 41.71,47.09 IC2.9
  Bottom 0.254: IC2.9 41.93,46.86 51.54,37.26 51.54,19.66 59.54,11.66 59.69,7.62
A8  (via drill 0.61)
  Top 0.254: v65.71,21.49 60.45,21.49 57.25,18.29 57.25,11.66 57.15,7.62 | CN2.P$24 52.22,90.07 53.14,90.07 59.08,84.12 59.77,84.12 61.14,82.75 61.14,34.06 65.94,29.26 IC3.2
  Bottom 0.254: v65.71,21.49 67.77,23.55 67.77,27.43 66.17,29.03 IC3.2
A9  (via drill 0.61)
  Top 0.254: IC3.3 66.17,31.55 67.77,29.95 67.77,28.8 67.08,28.12 v59.99,28.12 57.25,28.12 50.16,35.2 50.16,75.21 53.82,78.87 v53.82,85.5
  Bottom 0.254: v59.99,28.12 57.71,28.12 56.57,26.98 56.57,21.59 64.8,13.36 64.8,11.66 64.77,7.62 | v53.82,85.5 55.88,87.55 55.88,90.53 59.54,94.18 59.54,95.1 CN2.P$17
A10  (via drill 0.61)
  Top 0.254: 62.23,7.62 62.28,11.66 62.92,11.66 66.85,15.6 v68.76,15.6 | CN2.P$20 57.25,90.07 57.25,87.33 61.59,82.98 61.59,38.63 65.94,34.29 IC3.4
  Bottom 0.254: IC3.4 66.17,34.29 66.17,33.83 68.22,31.77 68.22,20.34 67.31,19.43 67.31,17.04 v68.76,15.6
A11  (via drill 0.61)
  Top 0.254: v69.37,54.41 69.37,81.38 66.17,84.58 66.17,90.53 63.65,93.04 63.65,95.56 62.74,96.47 59.31,96.47 58.17,95.33 57.25,95.33 CN2.P$19 | v62.28,13.03 63.2,13.03 68.58,18.41 68.58,19.33 v68.68,19.43
  Bottom 0.254: v68.68,19.43 68.68,33.83 66.17,36.35 66.17,36.8 IC3.5 66.17,37.03 70.05,40.92 70.05,53.72 v69.37,54.41 | v62.28,13.03 62.28,11.66 62.23,7.62
A12  (via drill 0.61)
  Top 0.254: v62.05,34.52 63.42,33.15 67.08,33.15 67.77,33.83 67.77,37.26 66.17,38.86 66.17,39.32 IC3.6 | v56.57,19.2 56.57,12.57 v56.34,12.34 | v60.22,37.72 60.22,82.98 59.54,83.67 57.02,83.67 50.85,89.84 50.85,90.53 48.34,93.04 48.34,95.78 49.02,96.47 49.94,96.47 51.08,95.33 51.99,95.33 CN2.P$23
  Bottom 0.254: v56.57,19.2 56.11,19.66 56.11,29.03 57.48,30.4 59.31,30.4 62.05,33.15 v62.05,34.52 60.22,36.35 v60.22,37.72 | v56.34,12.34 57.02,11.66 57.15,7.62
A13  (via drill 0.61)
  Top 0.254: v65.71,22.86 58.85,22.86 56.79,20.8 | 56.79,20.8 54.74,18.75 54.74,11.66 54.61,7.62 | v54.74,25.38 49.71,30.4 49.71,90.07 CN2.P$26 | 56.79,20.8 v54.74,22.86
  Bottom 0.254: v65.71,22.86 65.71,23.09 64.34,24.46 64.34,39.78 65.94,41.38 65.94,41.83 IC3.7 | v54.74,22.86 v54.74,25.38
A14  (via drill 0.61)
  Top 0.254: CN2.P$25 49.71,95.1 50.85,93.95 54.97,93.95 55.88,94.87 55.88,95.56 57.25,96.93 64.8,96.93 65.94,95.78 65.94,94.87 68.45,92.35 68.45,89.84 70.28,88.01 70.28,53.95 69.83,53.49 69.6,53.49 v69.14,53.03 68.68,53.49 v63.42,53.49 | v53.82,21.95 v53.82,12.34
  Bottom 0.254: v69.14,53.03 69.14,48.01 66.17,45.03 66.17,44.58 IC3.8 | v53.82,12.34 54.51,11.66 54.61,7.62 | v53.82,21.95 53.82,44.58 57.71,48.46 59.54,48.46 62.51,51.44 62.51,52.58 v63.42,53.49
A15
  Top 0.254: CN2.P$18 59.77,90.07 62.05,87.78 62.05,51.44 65.94,47.55 65.94,47.09 IC3.9 67.77,45.26 67.77,41.15 81.26,27.66 83.77,27.66 84.23,27.2 84.23,26.06 81.48,23.32 78.05,23.32 66.17,11.43 CN1.18
BA0
  Top 0.381: IC2.14 32.38,53.98 32.38,57.78 LB2.10
BA1
  Top 0.381: IC2.15 31.75,52.07 31.75,59.69 LB2.9
BA2
  Top 0.381: IC2.16 31.11,50.16 31.11,61.59 LB2.8
BA3
  Top 0.381: IC2.17 30.48,48.26 30.48,63.5 LB2.7
BA4
  Top 0.381: IC2.18 29.84,46.35 29.84,65.41 LB2.6
BA5
  Top 0.381: IC2.19 29.21,44.45 29.21,67.31 LB2.5
BA6
  Top 0.381: IC2.20 28.57,42.55 28.57,69.22 LB2.4
BA7
  Top 0.381: IC2.21 27.94,40.64 27.94,71.12 LB2.3
BA8
  Top 0.381: IC3.14 56.51,53.98 56.51,57.78 LB3.10
BA9
  Top 0.381: IC3.15 55.88,52.07 55.88,59.69 LB3.9
BA10
  Top 0.381: IC3.16 55.24,50.16 55.24,61.59 LB3.8
BA11
  Top 0.381: IC3.17 54.61,48.26 54.61,63.5 LB3.7
BA12
  Top 0.381: IC3.18 53.97,46.35 53.97,65.41 LB3.6
BA13
  Top 0.381: IC3.19 53.34,44.45 53.34,67.31 LB3.5
BA14
  Top 0.381: IC3.20 52.7,42.55 52.7,69.22 LB3.4
BA15
  Top 0.381: IC3.21 52.07,40.64 52.07,71.12 LB3.3
BBUSDIR
  Top 0.381: IC4.23 74.93,36.83 74.93,74.93 LB4.1
BCLOCK
  Bottom 0.381: IC1.23 5.08,34.29 5.08,77.47 LB1.1
BCS1
  Top 0.381: IC4.14 80.65,53.98 80.65,57.78 LB4.10
BCS2
  Top 0.381: IC4.15 80.01,52.07 80.01,59.69 LB4.9
BCS12
  Top 0.381: IC4.16 79.38,50.16 79.38,61.59 LB4.8
BD0
  Top 0.381: IC1.14 8.26,53.98 8.26,57.78 LB1.10
BD1
  Top 0.381: IC1.15 7.62,52.07 7.62,59.69 LB1.9
BD2
  Top 0.381: IC1.16 6.99,50.16 6.99,61.59 LB1.8
BD3
  Top 0.381: IC1.17 6.35,48.26 6.35,63.5 LB1.7
BD4
  Top 0.381: IC1.18 5.71,46.35 5.71,65.41 LB1.6
BD5
  Top 0.381: IC1.19 5.08,44.45 5.08,67.31 LB1.5
BD6
  Top 0.381: IC1.20 4.45,42.55 4.45,69.22 LB1.4
BD7
  Bottom 0.381: IC1.21 6.35,38.1 6.35,73.66 LB1.3
BGND  (52 unrouted)
  Bottom 0.254: 13.36,77.5 RN2.5 | 85.6,77.5 RN12.5 | 37.36,77.5 RN5.5 | 61.14,78.11 61.14,78.18 RN8.6 | 61.59,77.5 RN8.5 | 61.14,62.18 RN7.5 61.37,62.18 | 85.14,62.18 RN10.5 | 37.13,62.18 RN4.5
  Bottom 0.381: RN2.8 13.1,80.01 12.07,80.01 | RN2.7 12.94,79.38 12.07,79.38 | RN2.6 12.94,78.11 12.07,78.11 | RN2.5 13.1,77.47 12.07,77.47 | RN1.8 13.1,64.77 12.07,64.77 | RN1.7 12.94,64.14 12.07,64.14 | RN1.6 12.94,62.87 12.07,62.87 | RN1.5 13.1,62.23 12.07,62.23 | 13.1,69.85 12.07,69.85 | RN3.8 13.1,72.39 12.07,72.39 | RN3.7 12.94,71.75 12.07,71.75 | RN3.6 12.94,70.48 12.07,70.48 | RN5.8 37.23,80.01 36.2,80.01 | 37.06,79.38 36.2,79.38 | 37.06,78.11 36.2,78.11 | RN5.5 37.23,77.47 36.2,77.47 | RN6.8 37.23,72.39 36.2,72.39 | RN6.5 37.23,69.85 36.2,69.85 | RN6.6 37.06,70.48 36.2,70.48 | RN6.7 37.06,71.75 36.2,71.75 | RN4.8 37.23,64.77 36.2,64.77 | RN4.7 37.06,64.14 36.2,64.14 | RN4.6 37.06,62.87 36.2,62.87 | RN4.5 37.23,62.23 36.2,62.23 | RN7.5 61.36,62.23 60.32,62.23 | RN7.6 61.2,62.87 60.32,62.87 | RN7.7 61.2,64.14 60.32,64.14 | RN7.8 61.36,64.77 60.32,64.77 | RN9.8 61.36,72.39 60.32,72.39 | RN9.7 61.2,71.75 60.32,71.75 | RN9.6 61.2,70.48 60.32,70.48 | RN9.5 61.36,69.85 60.32,69.85 | RN8.8 61.36,80.01 60.32,80.01 | RN8.7 61.2,79.38 60.32,79.38 | RN8.6 61.2,78.11 | 61.14,78.11 60.32,78.11 | RN8.5 61.36,77.47 60.32,77.47 | RN12.8 85.49,80.01 84.45,80.01 | RN12.7 85.33,79.38 84.45,79.38 | RN12.6 85.33,78.11 84.45,78.11 | RN12.5 85.49,77.47 84.45,77.47 | RN11.8 85.49,72.39 84.45,72.39 | RN11.5 85.49,69.85 84.45,69.85 | 85.33,70.48 84.45,70.48 | 85.33,71.75 84.45,71.75 | RN10.5 85.49,62.23 84.45,62.23 | RN10.6 85.33,62.87 84.45,62.87 | RN10.7 85.33,64.14 84.45,64.14 | RN10.8 85.49,64.77 84.45,64.77
BINT
  Top 0.381: IC3.22 51.43,38.73 51.43,73.03 LB3.2
BIORQ
  Top 0.381: IC4.21 76.2,40.64 76.2,71.12 LB4.3
BM1
  Top 0.381: IC4.20 76.84,42.55 76.84,69.22 LB4.4
BMERQ
  Top 0.381: IC4.22 75.56,38.73 75.56,73.03 LB4.2
BNA
  Bottom 0.381: LB1.2 5.71,75.56 5.71,36.2 IC1.22
BRD
  Top 0.381: IC2.23 26.67,36.83 26.67,74.93 LB2.1
BRESET
  Top 0.381: IC3.23 50.8,36.83 50.8,74.93 LB3.1
BRFSH
  Top 0.381: IC4.18 78.11,46.35 78.11,65.41 LB4.6
BSLTSL
  Top 0.381: IC4.17 78.74,48.26 78.74,63.5 LB4.7
BUSDIR  (via drill 0.61)
  Top 0.254: 88.34,53.95 90.17,52.12 IC4.11 | 88.34,53.95 88.34,55.78 v89.48,56.92 | v74.17,12.34 74.85,11.66 74.93,7.62 | 88.34,53.95 v88.11,53.95
  Bottom 0.254: v89.48,56.92 92,59.44 92,82.98 87.66,87.33 72.8,87.33 70.05,90.07 CN2.P$10 | v74.17,12.34 74.17,43.43 81.71,50.98 83.77,50.98 86.74,53.95 v88.11,53.95
BWAIT
  Top 0.381: IC4.19 77.47,44.45 77.47,67.31 LB4.5
BWR
  Top 0.381: IC2.22 27.3,38.73 27.3,73.03 LB2.2
CLOCK  (via drill 0.61)
  Top 0.254: 33.71,1.14 34.29,1.27 | v26.85,87.78 20.45,81.38 20.45,55.09 17.93,52.58 17.93,52.12 IC1.11 | v32.11,22.17 32.11,14.17 34.16,12.12 34.16,11.66 34.29,7.62
  Bottom 0.254: v26.85,87.78 29.13,90.07 CN2.P$42 | v32.11,22.17 32.11,24.46 27.08,29.49 27.08,44.35 19.53,51.89 17.93,51.89 IC1.11
CS1  (via drill 0.61)
  Top 0.254: v93.37,31.77 95.2,33.6 95.2,81.84 81.94,95.1 80.11,95.1 CN2.P$1
  Bottom 0.254: 90.4,28.8 92,27.2 92,17.83 88.14,13.97 87,13.97 85.09,12.06 CN1.01 | 90.4,28.8 90.17,29.03 IC4.2 90.4,28.8 | 90.4,28.8 v93.37,31.77
CS2
  Top 0.254: 87.88,31.77 90.17,31.77 IC4.3 | 87.88,31.77 87.2,31.09 87.2,13.72 85.14,11.66 85.09,7.62 | 87.88,31.77 86.06,33.6 86.06,81.84 80.11,87.78 80.11,90.07 CN2.P$2
CS12  (via drill 0.61)
  Top 0.254: v91.08,18.29 92.46,19.66 92.46,32.23 91.08,33.6 90.86,33.6 IC4.4 94.74,38.86 94.74,81.61 82.63,93.73 79.88,93.73 78.51,95.1 77.6,95.1 CN2.P$3
  Bottom 0.254: v91.08,18.29 87.4,14.61 86.36,14.61 85.09,13.34 84.45,13.34 CN1.03
D0  (via drill 0.61)
  Top 0.254: v34.85,12.8 39.42,12.8 39.88,12.34 43.31,12.34 44.22,11.43 CN1.34 | CN2.P$34 39.19,90.07 39.19,86.87 35.99,83.67 35.99,28.8 35.31,28.12 18.85,28.12 17.93,29.03 IC1.2
  Bottom 0.254: v34.85,12.8 18.62,29.03 17.93,29.03 IC1.2
D1  (via drill 0.61)
  Top 0.254: v27.99,29.95 26.39,31.55 17.93,31.55 IC1.3 | v25.02,49.84 25.02,76.12 35.53,86.64 35.53,90.53 39.19,94.18 39.19,95.1 CN2.P$33
  Bottom 0.254: 44.45,7.62 44.45,12.8 27.99,29.26 v27.99,29.95 27.99,44.12 24.11,48.01 24.11,48.92 v25.02,49.84
D2  (via drill 0.61)
  Top 0.254: IC1.4 17.93,34.29 17.93,34.75 25.93,42.75 25.93,76.35 36.68,87.1 36.68,90.07 CN2.P$36 | v40.79,11.43 CN1.36 | v40.11,13.49 35.53,13.49 v33.02,16
  Bottom 0.254: v40.79,11.43 40.79,12.8 v40.11,13.49 | v33.02,16 33.02,16.69 19.53,30.18 19.53,32.69 17.93,34.29 IC1.4
D3  (via drill 0.61)
  Top 0.254: v27.76,25.38 25.48,27.66 17.25,27.66 16.1,28.8 16.1,34.75 17.7,36.35 17.7,36.8 IC1.5 17.7,37.03 15.19,39.55 15.19,82.75 20.22,87.78 v20.22,88.47
  Bottom 0.254: v27.76,25.38 27.76,24.69 35.31,17.14 38.96,17.14 41.93,14.17 41.93,11.66 41.91,7.62 | v20.22,88.47 20.22,90.53 21.13,91.44 32.11,91.44 35.76,95.1 36.68,95.1 CN2.P$35
D4  (via drill 0.61)
  Top 0.254: 24.11,48.46 24.11,78.64 34.16,88.7 34.16,90.07 CN2.P$38 | 24.11,48.46 24.11,45.72 17.93,39.55 IC1.6 | v38.28,11.66 39.19,11.66 39.37,7.62 | v38.28,15.77 38.28,20.57 v34.16,24.69 | 24.11,48.46 v25.02,48.46
  Bottom 0.254: v38.28,15.77 v38.28,11.66 | v34.16,24.69 28.91,29.95 28.91,44.58 v25.02,48.46
D5
  Top 0.254: IC1.7 21.82,45.95 21.82,77.04 33.02,88.24 33.02,90.53 34.16,91.67 34.16,95.1 CN2.P$37
  Bottom 0.254: IC1.7 17.7,42.06 16.1,43.66 16.1,47.55 16.56,48.01 18.85,48.01 26.16,40.69 26.16,25.6 35.08,16.69 38.73,16.69 39.19,16.23 39.19,11.66 39.37,7.62
D6  (via drill 0.61)
  Top 0.254: v35.76,11.89 36.45,11.89 36.68,11.66 36.83,7.62 | CN2.P$40 31.88,90.3 31.88,91.21 33.02,92.35 33.02,95.56 32.11,96.47 31.42,96.47 30.5,95.56 30.5,93.04 27.76,90.3 27.76,84.35 20.9,77.5 20.9,50.52 18.39,48.01 16.56,48.01 16.1,47.55 16.1,46.18 17.7,44.58 IC1.8
  Bottom 0.254: v35.76,11.89 35.76,14.63 25.25,25.15 25.25,36.58 17.93,43.89 17.93,44.35 IC1.8
D7
  Top 0.254: CN2.P$39 31.65,95.1 31.65,91.67 30.5,90.53 30.5,86.41 21.36,77.27 21.36,50.29 17.93,46.86 IC1.9
  Bottom 0.254: IC1.9 17.93,46.86 17.93,46.41 25.71,38.63 25.71,25.38 36.68,14.4 36.68,11.66 36.83,7.62
GND1
  Bottom 0.254: 15.24,25.15 15.19,25.15 14.92,25.09
  Bottom 0.381: C1.2 39.05,51.75 IC2.12 | 63.5,22.86 C4.2 63.18,51.75 IC3.12 | C3.2 87.31,51.75 IC4.12 | LED1.K 97.79,92.08 | IC1.10 14.92,49.53
  Bottom 0.508: 84.45,62.23 84.45,83.19 83.19,84.45 60.32,84.45 60.32,62.23 | 36.2,84.45 36.2,62.23 | 12.07,84.45 12.07,62.23
  Bottom 0.635: 36.2,84.45 60.32,84.45
  Bottom 0.762: CN2.P$41 31.75,97.79 96.52,97.79 97.79,96.52 97.79,92.08 97.79,56.52 95.89,54.61 IC4.12 87.63,57.15 68.58,57.15 IC3.12 63.5,57.15 44.45,57.15 IC2.12 39.37,57.15 20.32,57.15 | JP1.8 7.62,92.71 7.62,91.44 JP1.4 | CN1.41 31.75,11.43 31.75,12.7 26.67,17.78 C5.- | IC1.12 14.92,54.61
  Bottom 1.016: 26.67,84.45 12.07,84.45 7.62,84.45 7.62,87.63 JP1.4 | 26.67,84.45 36.2,84.45 | C5.- 18.01,19.77 C2.2 14.92,25.09 14.92,49.53 14.92,54.61 14.92,55.56 15.24,55.88 16.51,57.15 20.32,57.15 24.13,57.15 26.04,59.05 26.04,83.82 26.67,84.45
GND2  (1 unrouted)
  Top 0.762: 29.21,95.25 CN2.P$43 24.77,93.34 13.34,93.34 JP1.7
  Bottom 0.254: 31.65,10.52 31.75,7.62
  Bottom 0.762: CN2.P$43 24.77,93.34 20.96,93.34 19.68,92.08 13.97,92.08 | JP1.3 13.97,91.44 13.97,92.08 | 13.97,92.08 13.97,92.71 JP1.7 | 18.41,17.78 17.78,18.41 17.78,19.68 15.24,22.23
  Bottom 1.016: CN1.43 31.75,12.7 26.67,17.78 18.41,17.78
INT
  Top 0.254: 67.08,49.61 66.17,49.61 IC3.10 67.08,49.61 | 67.08,49.61 72.34,54.86 72.34,90.07 CN2.P$8 | 67.08,49.61 68.22,48.46 68.22,41.38 81.48,28.12 84,28.12 84.68,27.43 84.68,25.83 77.6,18.75 77.6,11.66 77.47,7.62
IORQ  (via drill 0.61)
  Top 0.254: v96.11,53.49 96.11,81.61 81.26,96.47 71.2,96.47 | 71.2,96.47 68.45,96.47 67.31,95.33 CN2.P$11 | v71.42,56.01 71.42,89.38 71.2,89.61 71.2,96.47
  Bottom 0.254: v96.11,53.49 93.6,50.98 89.48,50.98 88.34,49.84 88.34,48.92 90.17,47.09 IC4.9 | v71.42,56.01 72.34,55.09 72.34,11.66 72.39,7.62
M1  (via drill 0.61)
  Top 0.254: IC4.8 90.17,44.58 92,46.41 92,49.84 90.86,50.98 88.8,50.98 v86.97,52.81 86.97,81.61 81.03,87.55 v81.03,88.24
  Bottom 0.254: v86.97,52.81 86.97,52.35 84.23,49.61 84.23,28.8 83.08,27.66 81.26,27.66 75.08,21.49 75.08,11.66 74.93,7.62 | v81.03,88.24 80.34,88.24 78.74,89.84 78.74,90.53 77.83,91.44 74.62,91.44 70.97,95.1 70.05,95.1 CN2.P$9
MREQ  (via drill 0.61)  (1 unrouted)
  Top 0.254: v87.88,81.61 87.88,59.89 92.46,55.32 92.46,44.58 91.31,43.43 89.03,43.43 88.34,44.12 88.34,47.55 90.17,49.38 IC4.10 | v76.68,16.23 72.57,12.12 72.57,11.66 72.39,7.62 | v88.34,30.86 v88.34,21.49
  Bottom 0.254: v87.88,81.61 86.97,81.61 81.71,86.87 70.51,86.87 67.31,90.07 | v76.68,16.23 82.86,16.23 88.11,21.49 v88.34,21.49 | v88.34,30.86 88.34,44.81 89.48,45.95 91.31,45.95 92,46.63 92,47.55 90.17,49.38 IC4.10
N$1
  Bottom 0.381: R2.1 88.58,94.3 LED1.A
RD  (via drill 0.61)
  Top 0.254: 63.42,55.78 63.42,88.92 64.57,90.07 CN2.P$14 | v69.83,13.72 69.83,11.66 69.85,7.62 | v68.45,55.32 67.54,55.32 67.08,55.78 63.42,55.78 | 63.42,55.78 v63.42,55.55
  Bottom 0.254: v63.42,55.55 61.37,53.49 57.71,53.49 56.34,52.12 41.93,52.12 IC2.11 | v69.83,13.72 69.83,40.01 70.51,40.69 70.51,54.63 69.83,55.32 v68.45,55.32
RESET
  Top 0.254: CN2.P$15 62.05,95.1 62.05,91.67 61.14,90.75 61.14,89.38 62.51,88.01 62.51,53.03 63.42,52.12 65.94,52.12 IC3.11
  Bottom 0.254: IC3.11 65.94,51.89 63.88,49.84 63.88,24.23 64.8,23.32 64.8,14.17 67.31,11.66 67.31,7.62
RFSH  (via drill 0.61)
  Top 0.254: 80.01,7.62 80.11,11.66 86.28,17.83 v86.28,18.29 85.6,18.97 85.6,81.61 83.54,83.67 82.4,83.67 76,90.07 75.08,90.07 CN2.P$6
  Bottom 0.254: v86.28,18.29 86.51,18.29 89.26,21.03 89.26,21.95 88.34,22.86 88.34,29.49 89.26,30.4 91.08,30.4 92,31.32 92,37.49 90.17,39.32 IC4.6
SLTSL  (via drill 0.61)
  Top 0.254: CN2.P$4 78.74,91.44 83.54,91.44 92.91,82.07 92.91,39.78 90.17,37.03 IC4.5 90.17,36.8 88.34,34.98 88.34,33.83 89.03,33.15 90.86,33.15 92,32 92,26.29 v90.17,24.46 | 82.55,7.62 82.63,11.66 82.63,12.29 v85.65,15.32
  Bottom 0.254: v85.65,15.32 87.43,15.32 90.17,18.06 v90.17,24.46
SNDIN  (via drill 0.6)
  Top 0.508: CN2.P$49 18.41,95.89 2.54,95.89 1.27,94.61 v1.27,87
  Bottom 0.508: CN1.49 24.13,12.06 22.23,13.97 13.97,13.97 10.79,17.14 10.79,22.23 9.53,23.5 2.54,23.5 1.27,24.77 v1.27,87
SW1  (via drill 0.6, 0.61)
  Top 0.254: v19.53,50.52 17.25,50.52 16.1,51.66 16.1,55.09 19.53,58.52 19.53,81.84 26.62,88.92 26.62,90.07 CN2.P$44 | 31.75,7.62 31.65,11.66 30.96,12.34 v30.96,22.86 29.69,21.59 v22.86,21.59
  Bottom 0.254: v19.53,50.52 19.53,48.01 26.62,40.92 26.62,27.89 30.96,23.55 v30.96,22.86 | SJ1.2 22.73,21.72 v22.86,21.59
SW2  (via drill 0.61)
  Top 0.254: v17.42,86.36 17.42,85.67 14.73,82.98 14.73,27.43 16.79,25.38 v19.71,25.38 | 29.21,7.62 29.13,11.66 25.48,15.32 v25.48,19.61 25.48,19.68
  Bottom 0.254: v17.42,86.36 19.48,86.36 23.19,90.07 24.11,90.07 CN2.P$46 | v19.71,25.38 20.98,25.38 25.4,20.95 25.4,20.32 | 25.4,20.32 25.4,19.68 v25.48,19.61 | SJ1.1 25.27,20.19 25.4,20.32
WAIT  (via drill 0.61)
  Top 0.254: v93.83,45.72 93.83,81.84 82.4,93.27 74.4,93.27 72.57,95.1 CN2.P$7 | v88.11,17.37 91.54,17.37 v94.29,20.12
  Bottom 0.254: v93.83,45.72 90.17,42.06 IC4.7 90.17,41.83 94.29,37.72 v94.29,20.12 | v88.11,17.37 84.91,17.37 79.2,11.66 77.6,11.66 77.47,7.62
WR  (via drill 0.61)
  Top 0.254: v43.76,86.87 42.85,85.95 42.85,85.04 43.76,84.12 43.76,51.44 41.93,49.61 IC2.10 | v59.44,17.2 65.71,17.2 v66.34,17.83
  Bottom 0.254: v43.76,86.87 50.39,86.87 53.36,89.84 53.36,90.53 56.79,93.95 57.48,93.95 58.39,94.87 58.39,95.56 59.31,96.47 63.42,96.47 64.57,95.33 CN2.P$13 | v66.34,17.83 66.34,15.77 69.83,11.66 69.85,7.62 | IC2.10 41.93,49.38 51.99,39.32 51.99,22.4 56.57,17.83 58.8,17.83 v59.44,17.2

### Text on the board
tNames: POWER | +5V MAIN | CLK | CLK | RD | RD | RST | RST | BUSD | BUSD | WR | WR | INT | INT | MREQ | MREQ | D7 | D7 | A7 | A7 | A15 | A15 | IORQ | IORQ | D6 | D6 | A6 | A6 | A14 | A14 | M1 | M1 | D5 | D5 | A5 | A5 | A13 | A13 | WAIT | WAIT | D4 | D4 | A4 | A4 | A12 | A12 | RFSH | RFSH | D3 | D3 | A3 | A3 | A11 | A11 | SLTS | SLTS | D2 | D2 | A2 | A2 | A10 | A10 | CS12 | CS12 | D1 | D1 | A1 | A1 | A9 | A9 | CS2 | CS2 | D0 | D0 | A0 | A0 | A8 | A8 | CS1 | CS1 | (C) 2020 | RBSC | iBOLIT | DIAGNOSTICS | CARTRIDGE
bNames: (C) 2020 | RBSC | SW1+2 | iBOLIT | + | 22-47uF | Board / Version 1.0